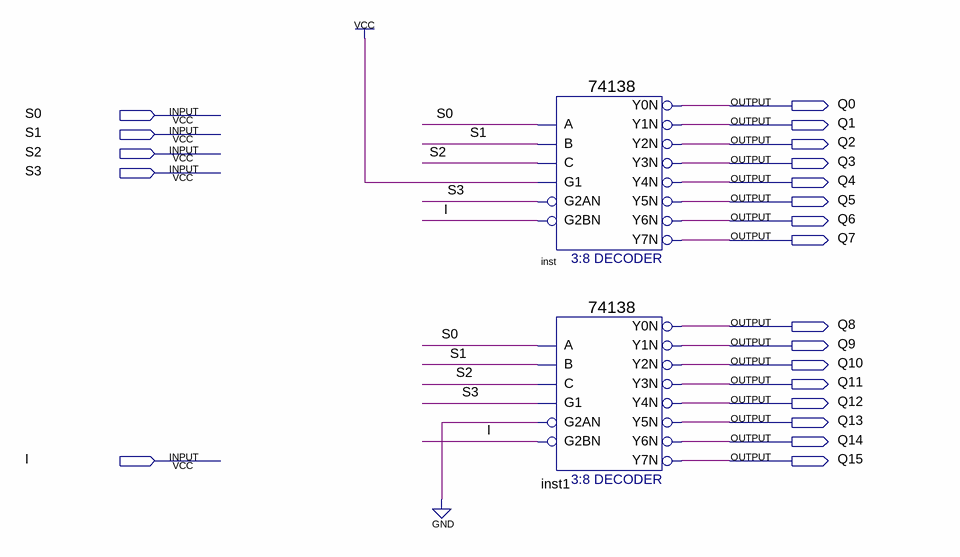
[diagram p0: schematic sheet]
// Quartus schematic one_to_sixteen_demux_seven_four_one_three_eight.bdf as structural Verilog: 2 symbols, 21 pins
module one_to_sixteen_demux_seven_four_one_three_eight (
  input  S0,
  input  S1,
  input  S2,
  input  S3,
  input  I,
  output Q0,
  output Q1,
  output Q2,
  output Q3,
  output Q4,
  output Q5,
  output Q6,
  output Q7,
  output Q8,
  output Q9,
  output Q10,
  output Q11,
  output Q12,
  output Q13,
  output Q14,
  output Q15
);

  \74138  inst (
    .A(S0), .B(S1), .G1(1'b1), .C(S2), .G2AN(S3), .G2BN(I), .Y0N(Q0), .Y1N(Q1), .Y2N(Q2), .Y3N(Q3), .Y4N(Q4),
    .Y5N(Q5), .Y6N(Q6), .Y7N(Q7));
  \74138  inst1 (
    .A(S0), .B(S1), .G1(S3), .C(S2), .G2AN(1'b0), .G2BN(I), .Y0N(Q8), .Y1N(Q9), .Y2N(Q10), .Y3N(Q11),
    .Y4N(Q12), .Y5N(Q13), .Y6N(Q14), .Y7N(Q15));
endmodule
